# EAGLE design DAC STM32 Board v4 - AD5391 (EAGLE 9.6.1)
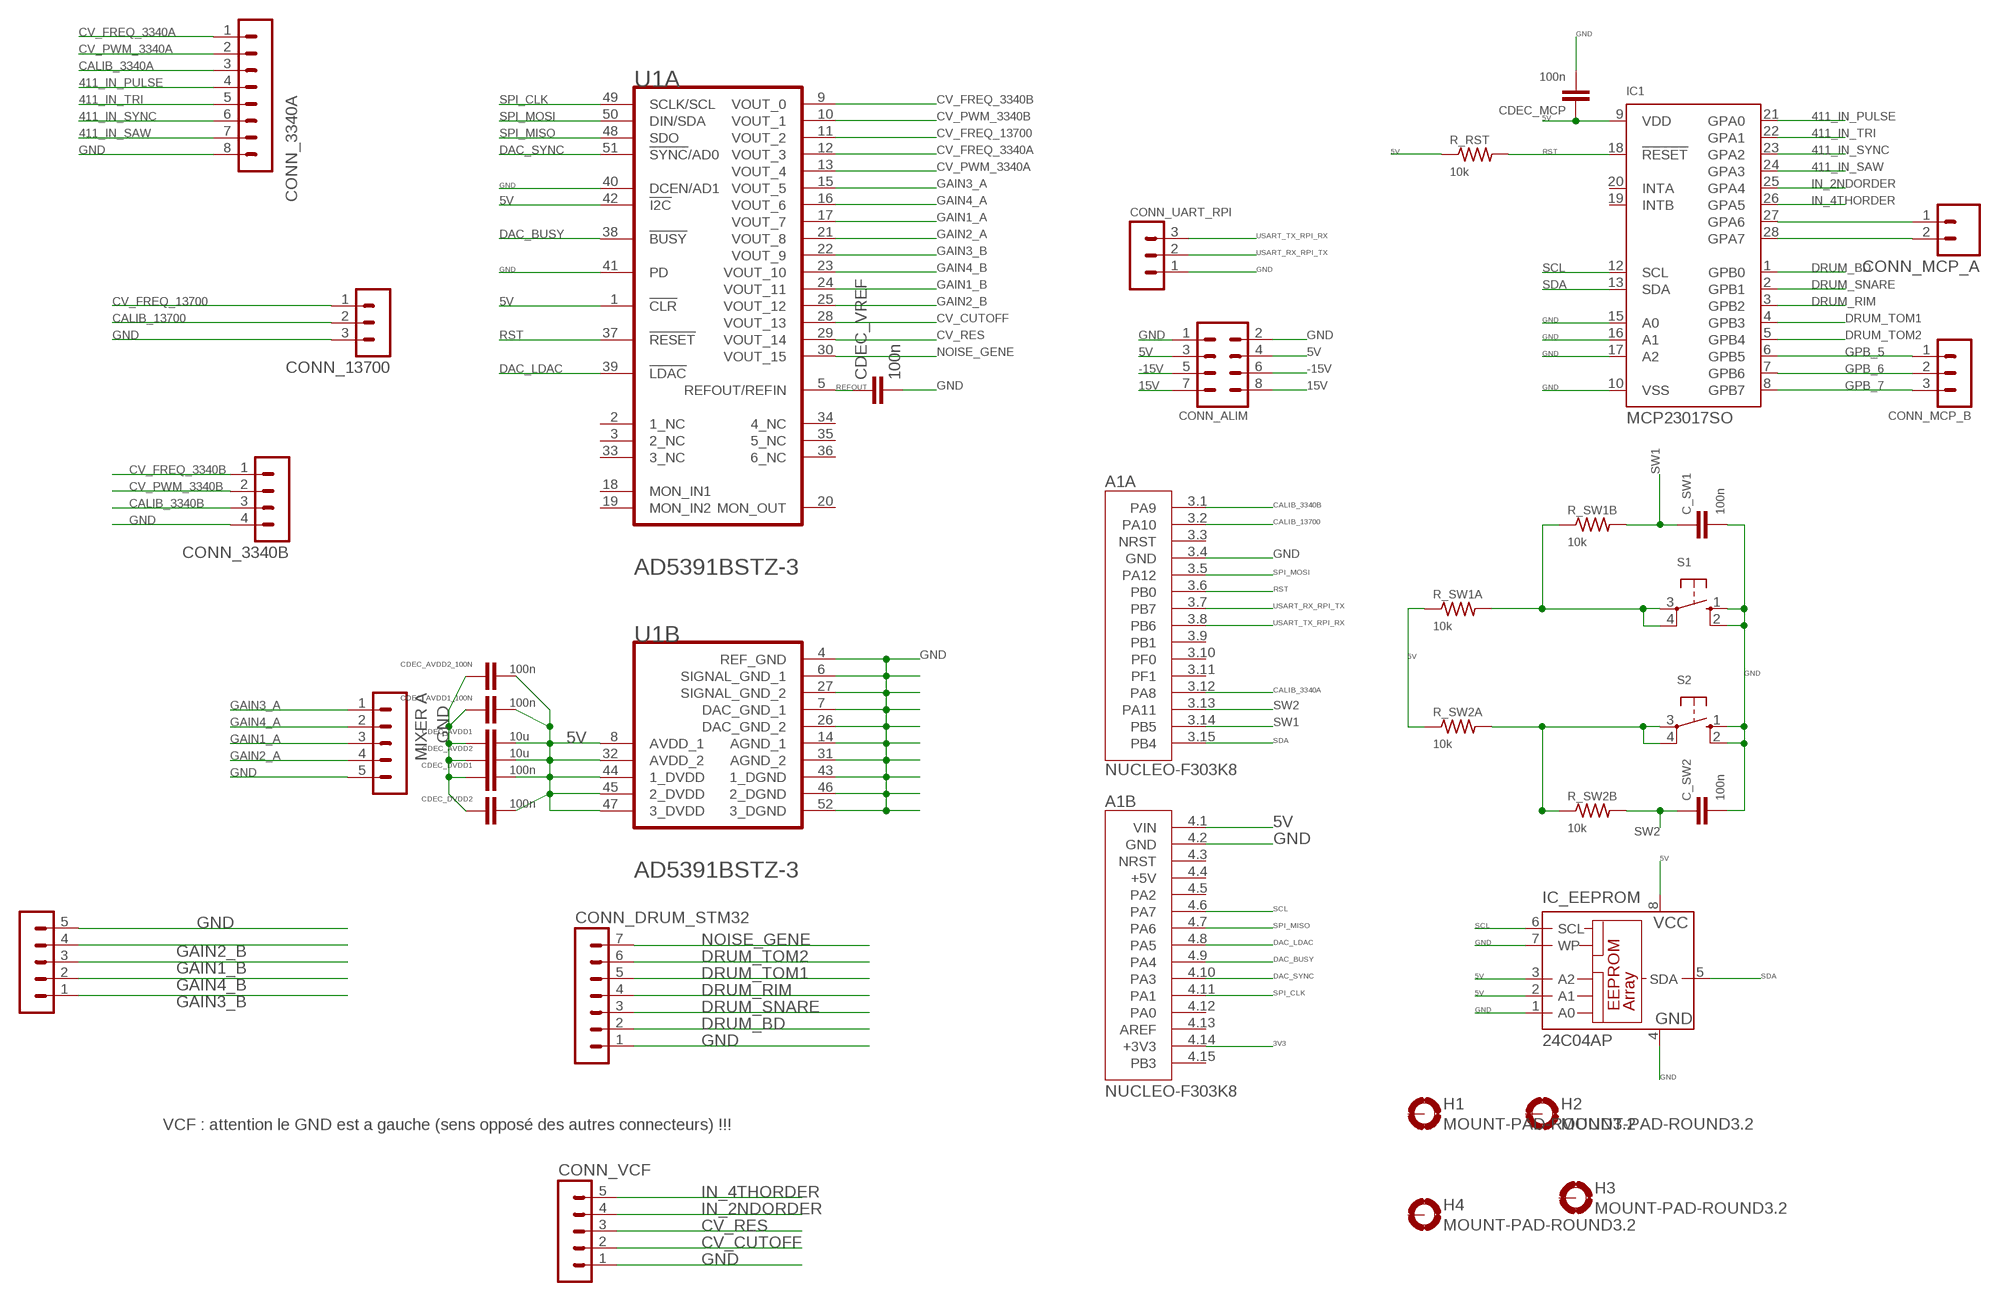
[diagram p0: schematic, sheet 1]

## Parts
A1  NUCLEO-F303K8  [MODULE_NUCLEO-F303K8]
C_SW1  100n  C-EU050-030X075  [C050-030X075]
C_SW2  100n  C-EU050-030X075  [C050-030X075]
CDEC_AVDD1  10u  C-EU050-030X075  [C050-030X075]
CDEC_AVDD1_100N  100n  C-EU050-030X075  [C050-030X075]
CDEC_AVDD2  10u  C-EU050-030X075  [C050-030X075]
CDEC_AVDD2_100N  100n  C-EU050-030X075  [C050-030X075]
CDEC_DVDD1  100n  C-EU075-032X103  [C075-032X103]
CDEC_DVDD2  100n  C-EU050-030X075  [C050-030X075]
CDEC_MCP  100n  C-EU075-032X103  [C075-032X103]
CDEC_VREF  100n  C-EU050-030X075  [C050-030X075]
CONN_3340A  MA08-1  [MA08-1]
CONN_3340B  MA04-1  [MA04-1]
CONN_13700  MA03-1  [MA03-1]
CONN_ALIM  MA04-2  [MA04-2]
CONN_DRUM_STM32  MA07-1  [MA07-1]
CONN_MCP_A  M02  [02P]
CONN_MCP_B  MA03-1  [MA03-1]
CONN_MIX_A  MA05-1  [MA05-1]
CONN_MIX_B  MA05-1  [MA05-1]
CONN_UART_RPI  MA03-1  [MA03-1]
CONN_VCF  MA05-1  [MA05-1]
H1  MOUNT-PAD-ROUND3.2  [3,2-PAD]
H2  MOUNT-PAD-ROUND3.2  [3,2-PAD]
H3  MOUNT-PAD-ROUND3.2  [3,2-PAD]
H4  MOUNT-PAD-ROUND3.2  [3,2-PAD]
IC1  MCP23017SO  [SO28W]
IC_EEPROM  24C04AP  [DIL8]
R_RST  10k  R-US_0207/10  [0207/10]
R_SW1A  10k  R-US_0207/10  [0207/10]
R_SW1B  10k  R-US_0207/10  [0207/10]
R_SW2A  10k  R-US_0207/10  [0207/10]
R_SW2B  10k  R-US_0207/10  [0207/10]
S1  10-XX  [B3F-10XX]
S2  10-XX  [B3F-10XX]
U1  ANALOG_DEVICES_AD5391BSTZ-3ANALOG_DEVICES_AD5391BSTZ-3_0_0  [ANALOG_DEVICES_AD5391BSTZ-3_0]

## Nets
3V3: A1.4.14(B:+3V3)
5V: A1.4.1(B:VIN) CDEC_AVDD1.2 CDEC_AVDD1_100N.2 CDEC_AVDD2.2 CDEC_AVDD2_100N.2 CDEC_DVDD1.2 CDEC_DVDD2.2 CDEC_MCP.1 CONN_ALIM.3 CONN_ALIM.4 IC1.9(VDD) IC_EEPROM.2(A1) IC_EEPROM.3(A2) IC_EEPROM.8(VCC) R_RST.1 R_SW1A.1 R_SW2A.1 U1.1(A:!CLR!) U1.8(B:AVDD_1) U1.32(B:AVDD_2) U1.42(A:!I2C!) U1.44(B:1_DVDD) U1.45(B:2_DVDD) U1.47(B:3_DVDD)
15V: CONN_ALIM.7 CONN_ALIM.8
411_IN_PULSE: CONN_3340A.4 IC1.21(GPA0)
411_IN_SAW: CONN_3340A.7 IC1.24(GPA3)
411_IN_SYNC: CONN_3340A.6 IC1.23(GPA2)
411_IN_TRI: CONN_3340A.5 IC1.22(GPA1)
-15V: CONN_ALIM.5 CONN_ALIM.6
CALIB_3340A: A1.3.12(A:PA8) CONN_3340A.3
CALIB_3340B: A1.3.1(A:PA9) CONN_3340B.3
CALIB_13700: A1.3.2(A:PA10) CONN_13700.2
CV_CUTOFF: CONN_VCF.2 U1.28(A:VOUT_13)
CV_FREQ_3340A: CONN_3340A.1 U1.12(A:VOUT_3)
CV_FREQ_3340B: CONN_3340B.1 U1.9(A:VOUT_0)
CV_FREQ_13700: CONN_13700.1 U1.11(A:VOUT_2)
CV_PWM_3340A: CONN_3340A.2 U1.13(A:VOUT_4)
CV_PWM_3340B: CONN_3340B.2 U1.10(A:VOUT_1)
CV_RES: CONN_VCF.3 U1.29(A:VOUT_14)
DAC_BUSY: A1.4.9(B:PA4) U1.38(A:!BUSY!)
DAC_LDAC: A1.4.8(B:PA5) U1.39(A:!LDAC!)
DAC_SYNC: A1.4.10(B:PA3) U1.51(A:!SYNC!/AD0)
DRUM_BD: CONN_DRUM_STM32.2 IC1.1(GPB0)
DRUM_RIM: CONN_DRUM_STM32.4 IC1.3(GPB2)
DRUM_SNARE: CONN_DRUM_STM32.3 IC1.2(GPB1)
DRUM_TOM1: CONN_DRUM_STM32.5 IC1.4(GPB3)
DRUM_TOM2: CONN_DRUM_STM32.6 IC1.5(GPB4)
GAIN1_A: CONN_MIX_A.3 U1.17(A:VOUT_7)
GAIN1_B: CONN_MIX_B.3 U1.24(A:VOUT_11)
GAIN2_A: CONN_MIX_A.4 U1.21(A:VOUT_8)
GAIN2_B: CONN_MIX_B.4 U1.25(A:VOUT_12)
GAIN3_A: CONN_MIX_A.1 U1.15(A:VOUT_5)
GAIN3_B: CONN_MIX_B.1 U1.22(A:VOUT_9)
GAIN4_A: CONN_MIX_A.2 U1.16(A:VOUT_6)
GAIN4_B: CONN_MIX_B.2 U1.23(A:VOUT_10)
GND: A1.3.4(A:GND) A1.4.2(B:GND) C_SW1.2 C_SW2.2 CDEC_AVDD1.1 CDEC_AVDD1_100N.1 CDEC_AVDD2.1 CDEC_AVDD2_100N.1 CDEC_DVDD1.1 CDEC_DVDD2.1 CDEC_MCP.2 CDEC_VREF.2 CONN_3340A.8 CONN_3340B.4 CONN_13700.3 CONN_ALIM.1 CONN_ALIM.2 CONN_DRUM_STM32.1 CONN_MIX_A.5 CONN_MIX_B.5 CONN_UART_RPI.1 CONN_VCF.1 IC1.10(VSS) IC1.15(A0) IC1.16(A1) IC1.17(A2) IC_EEPROM.1(A0) IC_EEPROM.4(GND) IC_EEPROM.7(WP) S1.1(S) S1.2(S1) S2.1(S) S2.2(S1) U1.4(B:REF_GND) U1.6(B:SIGNAL_GND_1) U1.7(B:DAC_GND_1) U1.14(B:AGND_1) U1.26(B:DAC_GND_2) U1.27(B:SIGNAL_GND_2) U1.31(B:AGND_2) U1.40(A:DCEN/AD1) U1.41(A:PD) U1.43(B:1_DGND) U1.46(B:2_DGND) U1.52(B:3_DGND)
GPB_5: CONN_MCP_B.1 IC1.6(GPB5)
GPB_6: CONN_MCP_B.2 IC1.7(GPB6)
GPB_7: CONN_MCP_B.3 IC1.8(GPB7)
IN_2NDORDER: CONN_VCF.4 IC1.25(GPA4)
IN_4THORDER: CONN_VCF.5 IC1.26(GPA5)
N$3: CONN_MCP_A.1 IC1.27(GPA6)
N$5: R_SW1A.2 R_SW1B.1 S1.3(P) S1.4(P1)
N$6: CONN_MCP_A.2 IC1.28(GPA7)
N$7: R_SW2A.2 R_SW2B.1 S2.3(P) S2.4(P1)
NOISE_GENE: CONN_DRUM_STM32.7 U1.30(A:VOUT_15)
REFOUT: CDEC_VREF.1 U1.5(A:REFOUT/REFIN)
RST: A1.3.6(A:PB0) IC1.18(!RESET) R_RST.2 U1.37(A:!RESET!)
SCL: A1.4.6(B:PA7) IC1.12(SCL) IC_EEPROM.6(SCL)
SDA: A1.3.15(A:PB4) IC1.13(SDA) IC_EEPROM.5(SDA)
SPI_CLK: A1.4.11(B:PA1) U1.49(A:SCLK/SCL)
SPI_MISO: A1.4.7(B:PA6) U1.48(A:SDO)
SPI_MOSI: A1.3.5(A:PA12) U1.50(A:DIN/SDA)
SW1: A1.3.14(A:PB5) C_SW1.1 R_SW1B.2
SW2: A1.3.13(A:PA11) C_SW2.1 R_SW2B.2
USART_RX_RPI_TX: A1.3.7(A:PB7) CONN_UART_RPI.2
USART_TX_RPI_RX: A1.3.8(A:PB6) CONN_UART_RPI.3
Unconnected: A1.3.3(A:NRST) A1.3.9(A:PB1) A1.3.10(A:PF0) A1.3.11(A:PF1) A1.4.3(B:NRST) A1.4.4(B:+5V) A1.4.5(B:PA2) A1.4.12(B:PA0) A1.4.13(B:AREF) A1.4.15(B:PB3) H1.B3,2(MOUNT) H2.B3,2(MOUNT) H3.B3,2(MOUNT) H4.B3,2(MOUNT) IC1.19(INTB) IC1.20(INTA) U1.2(A:1_NC) U1.3(A:2_NC) U1.18(A:MON_IN1) U1.19(A:MON_IN2) U1.20(A:MON_OUT) U1.33(A:3_NC) U1.34(A:4_NC) U1.35(A:5_NC) U1.36(A:6_NC)

## Notes on the sheet
- MIXER A
- VCF : attention le GND est a gauche (sens opposé des autres connecteurs) !!!

## Library data of the parts
A1 = NUCLEO-F303K8:NUCLEO-F303K8: STM32 Nucleo-32 development board with STM32F303K8T6 MCU, supports Arduino connectivity; DESCRIPTION: STM32 Nucleo-32 development board with STM32F303K8T6 MCU, supports Arduino connectivity; DIGI-KEY_PART_NUMBER: 497-15981-ND; DIGI-KEY_PURCHASE_URL: https://www.digikey.fr/product-detail/en/stmicroelectronics/NUCLEO-F303K8/497-15981-ND/5428805?utm_source=snapeda&utm_medium=aggregator&utm_campaign=symbol; MF: STMicroelectronics; MP: NUCLEO-F303K8; PACKAGE: None
C_SW1 C_SW2 CDEC_AVDD1 CDEC_AVDD1_100N CDEC_AVDD2 CDEC_AVDD2_100N CDEC_DVDD1 CDEC_DVDD2 CDEC_MCP CDEC_VREF = 6P1_EVB:C-EU: CAPACITOR, European symbol
CONN_3340A = con-lstb:MA08-1: PIN HEADER; OC_FARNELL: unknown; OC_NEWARK: unknown
CONN_3340B = con-lstb:MA04-1: PIN HEADER; OC_FARNELL: unknown; OC_NEWARK: unknown
CONN_13700 CONN_MCP_B CONN_UART_RPI = con-lstb:MA03-1: PIN HEADER; OC_FARNELL: unknown; OC_NEWARK: unknown
CONN_ALIM = con-lstb:MA04-2: PIN HEADER; OC_FARNELL: unknown; OC_NEWARK: unknown
CONN_DRUM_STM32 = con-lstb:MA07-1: PIN HEADER; OC_FARNELL: unknown; OC_NEWARK: unknown
CONN_MCP_A = con-amp-quick:M02: AMP QUICK CONNECTOR; OC_FARNELL: unknown; OC_NEWARK: unknown
CONN_MIX_A CONN_MIX_B CONN_VCF = con-lstb:MA05-1: PIN HEADER; OC_FARNELL: unknown; OC_NEWARK: unknown
H1-H4 = holes:MOUNT-PAD-ROUND: MOUNTING PAD, round
IC1 = microchip:MCP23017: http://ww1.microchip.com/downloads/en/DeviceDoc/21952a.pdf Source: http://ww1.microchip.com/downloads/en/DeviceDoc/21952a.pdf; MF: MICROCHIP; MPN: MCP23017-E/SO; OC_FARNELL: 1332087; OC_NEWARK: 31K2958
IC_EEPROM = microchip:24C*: Serial EEPROM 1 K/2 K/4 K; MPN: AT24C04B-PU; OC_FARNELL: 1362642; OC_NEWARK: 50M3315
R_RST R_SW1A R_SW1B R_SW2A R_SW2B = 6P1_EVB:R-US_: RESISTOR, American symbol
S1 S2 = switch-omron:10-XX: OMRON SWITCH; MPN: B3F-1000; OC_FARNELL: 176432; OC_NEWARK: 36M3542
U1 = Analog Devices - AD5391BSTZ-3:ANALOG_DEVICES_AD5391BSTZ-3: ADI-AD5391-ST-52; CIIVA_IDS: 963769; CODE__JEDEC: MS-026-BCC; COMPONENT_LINK_1_DESCRIPTION: Manufacturer URL; COMPONENT_LINK_1_URL: http://www.analog.com/en/index.html; COMPONENT_LINK_3_DESCRIPTION: Package Specification; COMPONENT_LINK_3_URL: http://www.analog.com/static/imported-files/packages/61012411624300842189414155189544791816408612ST_52_10x10.pdf; COMPONENT_LINK_4_DESCRIPTION: Product URL; COMPONENT_LINK_4_URL: http://www.analog.com/en/digital-to-analog-converters/da-converters/ad5391/products/product.html; COMPONENT_LINK_5_DESCRIPTION: Reference Design URL; COMPONENT_LINK_5_URL: http://www.analog.com/en/digital-to-analog-converters/da-converters/ad5391/products/product.html#prod_cross_sell; DAC_OUTPUTS: 16; DATASHEET: http://www.analog.com/static/imported-files/data_sheets/AD5390_5391_5392.pdf; DATASHEET_VERSION: Rev. D; FOOTPRINT_VARIANT_NAME_0: Level C; FOOTPRINT_VARIANT_NAME_1: Level B; FOOTPRINT_VARIANT_NAME_2: Level A; IMPORTED: yes; IMPORTED_FROM: vault; IMPORT_TS: 1521844584; MAX_V: 5.5V; MF: Analog Devices; MOUNTING_TECHNOLOGY: Surface Mount; MPN: AD5391BSTZ-3; PACKAGE: ST-52; PACKAGE_DESCRIPTION: 52-Lead Low Profile Quad Flat Package [LQFP]; PACKAGE_VERSION: 2003; PACKING: Tray; PIN_0_0_34_INSIDE_EDGE: clock; PREFIX: U; RELEASE_DATE: 1387056567; RESOLUTION_BITS: 12; ROHS: Yes; SETTLING_TIME: 6Âμs; SINGLE_SUPPLY: Yes; VAULT_GUID: 913198B3-F412-43EF-AC7C-B6DE02DEBA47; VAULT_REVISION: 29455BC3-2BA2-49F7-B0A5-12DEF9066172

## Board
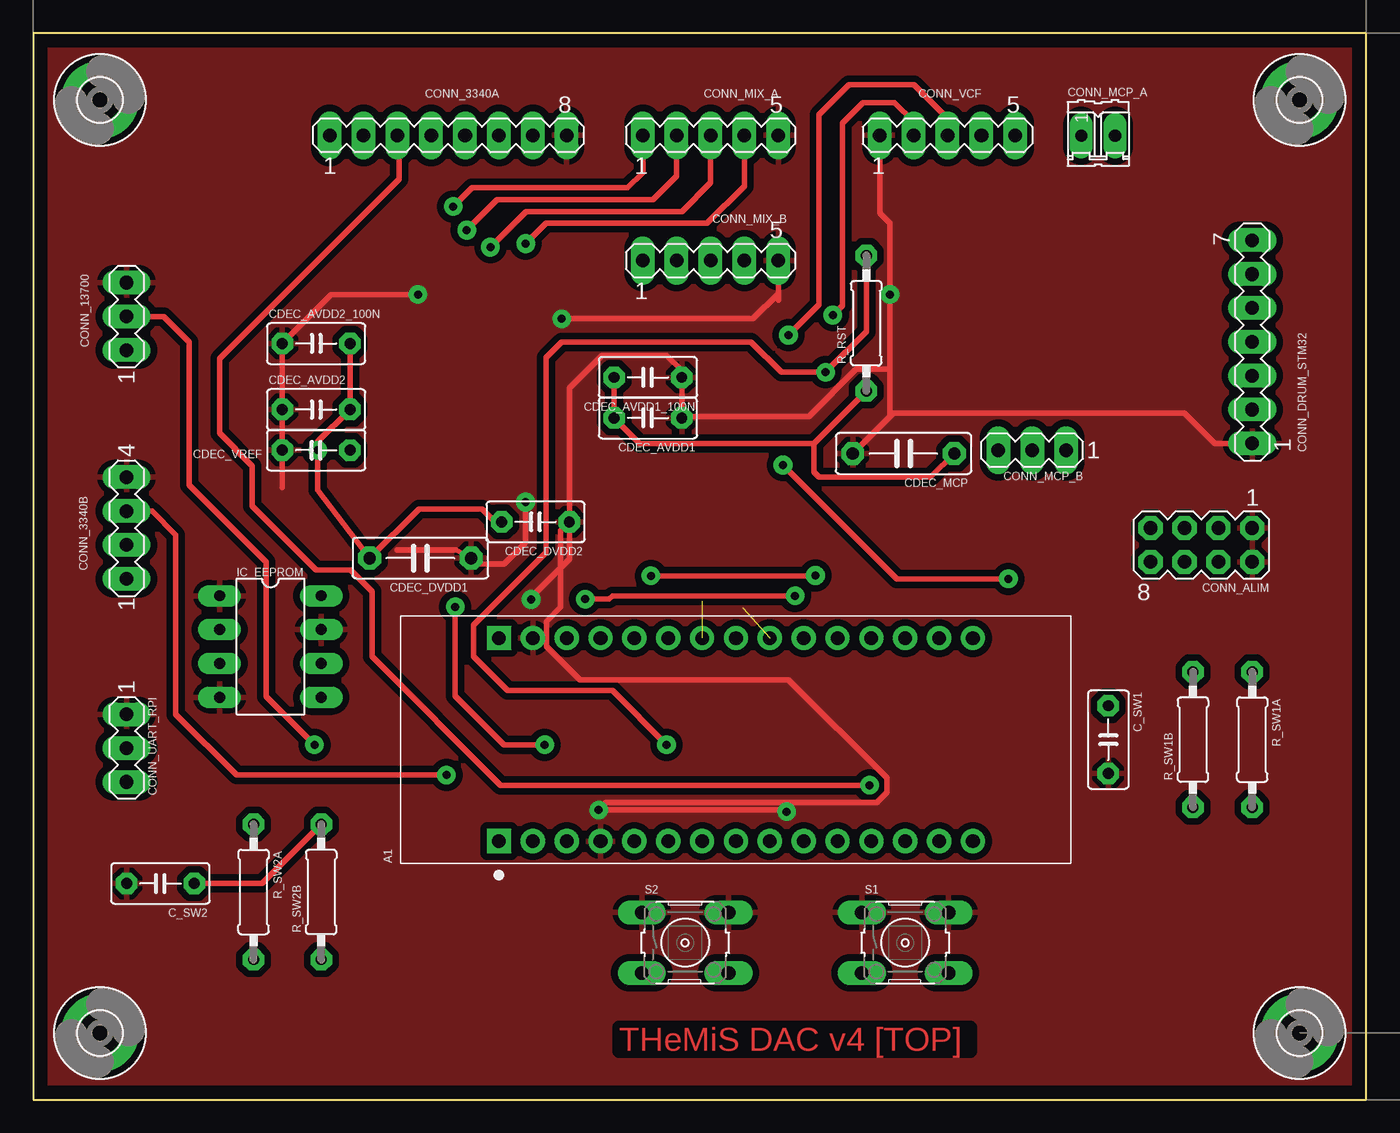
[diagram p1: board, top side]
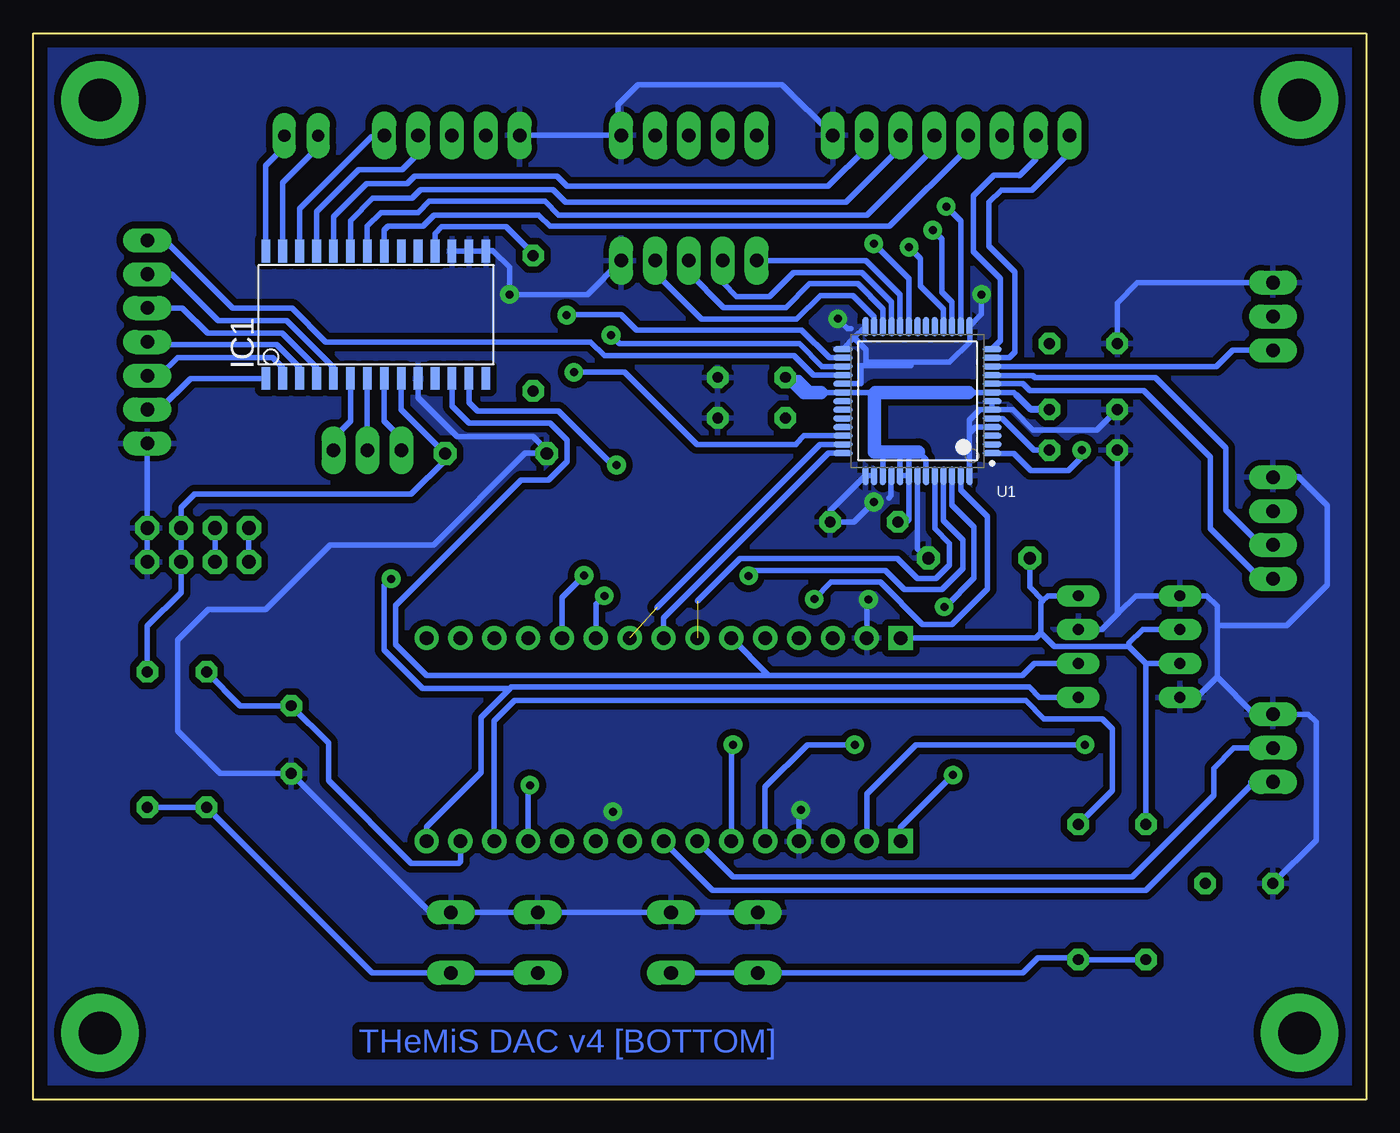
[diagram p2: board, bottom side, seen from below]

Size 100 x 80 mm. Coordinates in mm from the lower left corner, seen from the top.
Outline: 0,0 100,0 100,80 0,80 0,0
Copper layers (1*16): Top 0.035mm / dielectric 1.5mm / Bottom 0.035mm
Design rules "ENSEA_2019 *": minimum track width 0.4mm, minimum drill 0.6mm, track to track 0.4mm, track to pad 0.4mm, pad to pad 0.4mm, via to via 0.4mm, smd to smd 0.4mm, copper to edge 1mm, drill to drill 0.4mm, minimum pad ring 0.4mm, minimum via ring 0.4mm, stop-mask expansion 4mil, vias tented up to drill 0mil, thermal gap 0.4mm

### Footprints (pad centres in the part's own frame; a part is rotated, then mirrored left to right if it is on the bottom)
MODULE_NUCLEO-F303K8 = drill 1.02 square: 3.1 -7.62,17.78; 4.1 7.62,17.78 | drill 1.02: 3.2 -7.62,15.24; 3.3 -7.62,12.7; 3.4 -7.62,10.16; 3.5 -7.62,7.62; 3.6 -7.62,5.08; 3.7 -7.62,2.54; 3.8 -7.62,0; 3.9 -7.62,-2.54; 3.10 -7.62,-5.08; 3.11 -7.62,-7.62; 3.12 -7.62,-10.16; 3.13 -7.62,-12.7; 3.14 -7.62,-15.24; 3.15 -7.62,-17.78; 4.2 7.62,15.24; 4.3 7.62,12.7; 4.4 7.62,10.16; 4.5 7.62,7.62; 4.6 7.62,5.08; 4.7 7.62,2.54; 4.8 7.62,0; 4.9 7.62,-2.54; 4.10 7.62,-5.08; 4.11 7.62,-7.62; 4.12 7.62,-10.16; 4.13 7.62,-12.7; 4.14 7.62,-15.24; 4.15 7.62,-17.78
C050-030X075 = drill 0.813 octagon: 1 -2.54,0; 2 2.54,0
C075-032X103 = drill 0.914 octagon: 1 -3.81,0; 2 3.81,0
MA08-1 = drill 1.016 long: 1 -8.89,0; 2 -6.35,0; 3 -3.81,0; 4 -1.27,0; 5 1.27,0; 6 3.81,0; 7 6.35,0; 8 8.89,0
MA04-1 = drill 1.016 long: 1 -3.81,0; 2 -1.27,0; 3 1.27,0; 4 3.81,0
MA03-1 = drill 1.016 long: 1 -2.54,0; 2 0,0; 3 2.54,0
MA04-2 = drill 1.016 octagon: 1 -3.81,-1.27; 2 -3.81,1.27; 3 -1.27,-1.27; 4 -1.27,1.27; 5 1.27,-1.27; 6 1.27,1.27; 7 3.81,-1.27; 8 3.81,1.27
MA07-1 = drill 1.016 long: 1 -7.62,0; 2 -5.08,0; 3 -2.54,0; 4 0,0; 5 2.54,0; 6 5.08,0; 7 7.62,0
02P = drill 0.914 long: 1 -1.27,0; 2 1.27,0
MA05-1 = drill 1.016 long: 1 -5.08,0; 2 -2.54,0; 3 0,0; 4 2.54,0; 5 5.08,0
3,2-PAD = drill 3.2 pad 5.842: B3,2 0,0
SO28W = smd 0.65 x 1.7: 1 -7.62,-4.78; 2 -6.35,-4.78; 3 -5.08,-4.78; 4 -3.81,-4.78; 5 -2.54,-4.78; 6 -1.27,-4.78; 7 0,-4.78; 8 1.27,-4.78; 9 2.54,-4.78; 10 3.81,-4.78; 11 5.08,-4.78; 12 6.35,-4.78; 13 7.62,-4.78; 14 8.89,-4.78; 15 8.89,4.78; 16 7.62,4.78; 17 6.35,4.78; 18 5.08,4.78; 19 3.81,4.78; 20 2.54,4.78; 21 1.27,4.78; 22 0,4.78; 23 -1.27,4.78; 24 -2.54,4.78; 25 -3.81,4.78; 26 -5.08,4.78; 27 -6.35,4.78; 28 -7.62,4.78
DIL8 = drill 0.813 long: 1 -3.81,-3.81; 2 -1.27,-3.81; 3 1.27,-3.81; 4 3.81,-3.81; 5 3.81,3.81; 6 1.27,3.81; 7 -1.27,3.81; 8 -3.81,3.81
0207/10 = drill 0.813 octagon: 1 -5.08,0; 2 5.08,0
B3F-10XX = drill 1.016 long: 1 -3.251,2.261; 2 3.251,2.261; 3 -3.251,-2.261; 4 3.251,-2.261
ANALOG_DEVICES_AD5391BSTZ-3_0 = smd 1.45 x 0.45: 1 -5.6,3.9; 2 -5.6,3.25; 3 -5.6,2.6; 4 -5.6,1.95; 5 -5.6,1.3; 6 -5.6,0.65; 7 -5.6,0; 8 -5.6,-0.65; 9 -5.6,-1.3; 10 -5.6,-1.95; 11 -5.6,-2.6; 12 -5.6,-3.25; 13 -5.6,-3.9; 27 5.6,-3.9; 28 5.6,-3.25; 29 5.6,-2.6; 30 5.6,-1.95; 31 5.6,-1.3; 32 5.6,-0.65; 33 5.6,0; 34 5.6,0.65; 35 5.6,1.3; 36 5.6,1.95; 37 5.6,2.6; 38 5.6,3.25; 39 5.6,3.9 | smd 0.45 x 1.45: 14 -3.9,-5.6; 15 -3.25,-5.6; 16 -2.6,-5.6; 17 -1.95,-5.6; 18 -1.3,-5.6; 19 -0.65,-5.6; 20 0,-5.6; 21 0.65,-5.6; 22 1.3,-5.6; 23 1.95,-5.6; 24 2.6,-5.6; 25 3.25,-5.6; 26 3.9,-5.6; 40 3.9,5.6; 41 3.25,5.6; 42 2.6,5.6; 43 1.95,5.6; 44 1.3,5.6; 45 0.65,5.6; 46 0,5.6; 47 -0.65,5.6; 48 -1.3,5.6; 49 -1.95,5.6; 50 -2.6,5.6; 51 -3.25,5.6; 52 -3.9,5.6

### Placement (x,y rotation side)
A1  52.72,27 90 top
C_SW1  80.66,27 270 top
C_SW2  9.54,16.21 180 top
CDEC_AVDD1  46.11,51.13 180 top
CDEC_AVDD1_100N  46.11,54.18 180 top
CDEC_AVDD2  21.22,51.77 0 top
CDEC_AVDD2_100N  21.22,56.72 0 top
CDEC_DVDD1  29.04,40.62 180 top
CDEC_DVDD2  37.68,43.34 180 top
CDEC_MCP  65.29,48.47 180 top
CDEC_VREF  21.22,48.72 180 top
CONN_3340A  31.12,72.34 0 top
CONN_3340B  7,42.88 90 top
CONN_13700  7,58.76 90 top
CONN_ALIM  87.64,41.61 180 top
CONN_DRUM_STM32  91.45,56.85 90 top
CONN_MCP_A  79.89,72.32 0 top
CONN_MCP_B  74.94,48.72 180 top
CONN_MIX_A  50.81,72.34 0 top
CONN_MIX_B  50.81,62.95 0 top
CONN_UART_RPI  7,26.37 270 top
CONN_VCF  68.59,72.34 0 top
H1  5,5 0 top
H2  95,5 0 top
H3  95,75 0 top
H4  5,75 0 top
IC1  74.94,58.88 0 bottom
IC_EEPROM  17.79,33.99 270 top
R_RST  62.49,58.25 90 top
R_SW1A  91.45,27 270 top
R_SW1B  87,27 90 top
R_SW2A  16.52,15.57 270 top
R_SW2B  21.6,15.57 90 top
S1  65.42,11.77 0 top
S2  48.91,11.77 0 top
U1  33.66,52.41 180 bottom

### Tracks (layer width: path | path; a pad name or v marks a point on that pad's centre or on a via)
5V  (via drill 0.6)
  Top 0.4: CDEC_AVDD1_100N.2 CDEC_AVDD1.2 45.48,49.23 58.56,49.23 | CDEC_AVDD2_100N.2 CDEC_AVDD2.2 21.35,49.36 v21.35,48.72 21.35,45.72 CDEC_DVDD1.2 28.94,44.32 33.67,44.32 34.66,43.34 CDEC_DVDD2.2 | R_RST.1 58.56,49.23 | CDEC_MCP.1 67.32,46.69 58.94,46.69 58.56,47.07 58.56,49.23
  Bottom 0.4: IC1.9 72.4,51.77 CDEC_MCP.1 69.1,47.96 71.64,45.42 87.89,45.42 88.91,44.4 CONN_ALIM.3 CONN_ALIM.4 88.91,38.05 91.45,35.51 R_SW1A.1 | CDEC_AVDD1_100N.2 43.31,54.18 42.55,54.18 41.43,53.05 | 40.89,53.05 U1.32 36.83,53.05 | 26.43,53.04 U1.8 29.84,53.05 | U1.1 28.03,48.47 26.43,48.47 25.16,47.2 22.36,47.2 21.35,48.21 v21.35,48.72 | U1.45 U1.44 34.97,48.58 34.95,48.59 | U1.45 34.31,43.53 34.51,43.34 CDEC_DVDD2.2 | IC_EEPROM.8 23.89,37.8 24.24,37.45 | 24.24,37.45 24.39,37.29 24.39,35.01 | 24.39,35.01 23.38,33.99 17.79,33.99 | 16.52,32.72 17.79,33.99 | 16.52,32.72 IC_EEPROM.3 | 17.79,33.99 17.79,34.24 16.77,35.26 IC_EEPROM.2 | A1.4.1 24.77,34.62 24.39,35.01 | R_SW2A.1 16.52,32.72 | CDEC_DVDD1.2 25.23,38.44 24.24,37.45 | U1.47 33.02,48 33.6,48.59 34.37,48.59 | 34.37,48.59 34.95,48.59 | 34.95,48.59 36.27,48.59 U1.42 | U1.45 34.31,48.54 34.37,48.59
  Bottom 0.508: CDEC_AVDD2.2 25.16,51.77 26.24,52.85
  Bottom 1.016: 29.84,53.05 36.83,53.05 36.9,52.98 36.9,48.59 36.27,48.59 33.6,48.59 | 43.31,54.18 42.18,53.05 41.43,53.05 40.89,53.05
15V
  Bottom 0.4: CONN_ALIM.7 CONN_ALIM.8
411_IN_PULSE
  Bottom 0.4: IC1.21 73.67,65.23 73.39,65.52 70.77,65.52 69.92,66.38 62.08,66.38 61.22,65.52 35.77,65.52 29.86,71.44 CONN_3340A.4
411_IN_SAW
  Bottom 0.4: IC1.24 77.48,66.25 74.99,68.74 71.94,68.74 71.38,69.3 60.72,69.3 59.95,68.53 40.38,68.53 37.48,71.44 CONN_3340A.7
411_IN_SYNC
  Bottom 0.4: IC1.23 76.21,65.94 74.54,67.62 71.59,67.62 70.93,68.28 61.02,68.28 60.08,67.34 39.03,67.34 34.94,71.44 CONN_3340A.6
411_IN_TRI
  Bottom 0.4: IC1.22 74.94,65.54 73.92,66.56 71.13,66.56 70.3,67.39 61.62,67.39 60.59,66.36 37.47,66.36 32.4,71.44 CONN_3340A.5
-15V
  Bottom 0.4: CONN_ALIM.5 CONN_ALIM.6
CALIB_3340A  (via drill 0.6)
  Top 0.4: v62.75,23.58 35.06,23.58 25.41,33.23 25.41,38.13 23.81,39.73 21.23,39.73 16.43,44.53 16.43,47.54 13.98,49.99 13.98,55.58 27.44,69.04 27.44,72.22 CONN_3340A.3
  Bottom 0.4: A1.3.12 62.88,23.45 v62.75,23.58
CALIB_3340B  (via drill 0.6)
  Top 0.4: v31,24.34 15.25,24.34 10.68,28.91 10.68,42.37 8.9,44.15 CONN_3340B.3
  Bottom 0.4: v31,24.34 34.94,20.4 A1.3.1
CALIB_13700  (via drill 0.6)
  Top 0.4: v21.09,26.62 17.47,30.24 17.47,40.34 11.69,46.12 11.69,56.85 9.79,58.76 CONN_13700.2
  Bottom 0.4: A1.3.2 37.48,22.94 33.79,26.62 v21.09,26.62
CV_CUTOFF  (via drill 0.6)
  Top 0.4: v59.98,58.85 60.72,59.58 60.72,73.27 62.24,74.79 64.62,74.79 66.05,73.36 CONN_VCF.2
  Bottom 0.4: U1.28 40.28,55.66 42.36,57.74 54.75,57.74 55.89,58.88 59.95,58.88 v59.98,58.85
CV_FREQ_3340A
  Bottom 0.4: U1.12 26.77,55.66 26.36,56.07 26.36,62.08 28.32,64.04 28.32,65.76 28.31,65.77 28.31,67.32 27.38,68.25 25.07,68.25 22.38,70.94 22.38,72.2 CONN_3340A.1
CV_FREQ_3340B
  Bottom 0.4: U1.9 25.75,53.7 25.25,53.2 16.68,53.2 11.69,48.21 11.69,42.86 7.9,39.07 CONN_3340B.1
CV_FREQ_13700
  Bottom 0.4: CONN_13700.1 10.02,56.22 11.23,55.01 U1.11
CV_PWM_3340A
  Bottom 0.4: CONN_3340A.2 24.77,70.57 26.02,69.32 26.04,69.34 27.94,69.34 29.46,67.82 29.46,63.63 27.43,61.59 27.43,56.94 U1.13
CV_PWM_3340B
  Bottom 0.4: U1.10 28.04,54.33 25.02,54.33 24.87,54.18 15.81,54.18 10.53,48.9 10.53,44.23 7.9,41.61 CONN_3340B.2
CV_RES  (via drill 0.6)
  Top 0.4: v56.65,57.36 58.94,59.64 58.94,73.9 61.19,76.15 66.05,76.15 68.59,73.61 CONN_VCF.3
  Bottom 0.4: v56.65,57.36 56.02,56.72 42.53,56.72 40.81,55.01 U1.29
DAC_BUSY  (1 unrouted)
  Bottom 0.4: U1.38 40.98,49.16
  Bottom 0.406: 40.98,49.16 40.99,49.16 53.21,36.93
DAC_LDAC
  Bottom 0.4: A1.4.8 52.72,36.15 40.36,48.51 U1.39
DAC_SYNC  (via drill 0.6)
  Top 0.4: v57.16,37.8 43.44,37.8 43.19,37.55 v41.41,37.55
  Bottom 0.4: U1.51 30.41,45.74 28.44,43.76 28.44,38.32 31.1,35.66 33.3,35.66 36.46,38.82 40.14,38.82 v41.41,37.55 | A1.4.10 57.8,37.16 v57.16,37.8
DRUM_BD
  Bottom 0.4: CONN_DRUM_STM32.2 90.54,51.77 88.21,54.1 IC1.1
DRUM_RIM
  Bottom 0.4: CONN_DRUM_STM32.4 91.25,56.65 81.76,56.65 80.02,54.91 IC1.3
DRUM_SNARE
  Bottom 0.4: CONN_DRUM_STM32.3 90.54,54.31 89.17,55.68 82.06,55.68 81.29,54.91 IC1.2
DRUM_TOM1
  Bottom 0.4: CONN_DRUM_STM32.5 88.82,59.39 86.93,57.5 81.34,57.5 78.75,54.91 IC1.4
DRUM_TOM2
  Bottom 0.4: CONN_DRUM_STM32.6 89.61,61.93 86.12,58.44 81.01,58.44 77.48,54.91 IC1.5
GAIN1_A  (via drill 0.6)
  Top 0.4: v34.3,63.96 36.97,66.63 48.65,66.63 50.81,68.79 CONN_MIX_A.3
  Bottom 0.4: U1.17 31.71,59.31 33.43,61.02 33.43,63.09 v34.3,63.96
GAIN1_B
  Bottom 0.4: CONN_MIX_B.3 50.81,62.04 48.21,59.44 43.54,59.44 41.77,61.2 38.14,61.2 36.27,59.32 U1.24
GAIN2_A  (via drill 0.6)
  Top 0.4: v36.95,64.22 38.47,65.74 50.56,65.74 53.35,68.53 CONN_MIX_A.4
  Bottom 0.4: U1.21 34.31,61.58 v36.95,64.22
GAIN2_B
  Bottom 0.4: CONN_MIX_B.4 53.35,62.04 49.86,58.55 42.73,58.55 40.95,60.34 38.51,60.34 36.91,58.74 U1.25
GAIN3_A  (via drill 0.6)
  Top 0.4: v31.51,67.01 32.9,68.41 44.59,68.41 45.73,69.55 CONN_MIX_A.1
  Bottom 0.4: U1.15 30.41,65.92 v31.51,67.01
GAIN3_B
  Bottom 0.4: CONN_MIX_B.1 37.52,62.95 34.97,60.4 U1.22
GAIN4_A  (via drill 0.6)
  Top 0.4: v32.52,65.23 34.81,67.52 46.49,67.52 48.27,69.3 CONN_MIX_A.2
  Bottom 0.4: U1.16 31.07,59.82 31.84,60.59 31.84,64.55 v32.52,65.23
GAIN4_B
  Bottom 0.4: U1.23 35.62,59.82 37.82,62.02 42.98,62.02 44.77,60.24 47.23,60.24 48.27,61.28 CONN_MIX_B.2
GND  (via drill 0.6)
  Top 0.4: 48.65,51.26 CDEC_AVDD1_100N.1 48.65,54.69 47.51,55.83 42.68,55.83 40.22,53.37 CDEC_DVDD2.1 | 48.65,51.26 CDEC_AVDD1.1 | 64.27,54.82 64.27,51.26 CDEC_MCP.2 64.53,51.52 86.37,51.52 88.66,49.23 CONN_DRUM_STM32.1 | 64.27,54.82 v64.27,60.41 64.27,65.74 63.51,66.5 CONN_VCF.1 | 64.27,54.82 61.73,54.82 58.18,51.26 48.65,51.26 | 27.3,41.23 31.73,41.23 CDEC_DVDD1.1 33.29,40.18 35.31,40.18 36.93,41.81 v36.93,44.83 36.88,44.83 | 18.68,45.93 CDEC_VREF.2 CDEC_AVDD2.1 CDEC_AVDD2_100N.1 22.36,60.4 v28.85,60.4 | CDEC_DVDD2.1 40.22,40.54 37.35,37.67 v37.35,37.52 | CDEC_DVDD2.1 39.56,42.68 39.56,36.94 38.51,35.88 38.51,34 41.02,31.49 56.67,31.49 64.05,24.11 64.05,23.04 63.29,22.28 42.98,22.28 v42.42,21.72 56.39,21.72 v56.52,21.59 | 55.91,59.99 55.89,60.01 CONN_MIX_B.5 55.89,60.49 53.98,58.58 v39.65,58.58
  Bottom 0.4: U1.6 U1.7 | U1.6 26.5,51.76 24.99,50.25 20.2,50.25 CDEC_AVDD2.1 | U1.52 29.77,50 | 29.77,50 29.31,50.45 U1.4 | U1.6 28.98,51.76 29.77,50.97 29.77,50 | U1.41 U1.40 40.22,44.15 CDEC_DVDD2.1 38.42,43.34 v36.93,44.83 | U1.31 37.92,53.7 37.92,55.06 37.52,55.06 | 37.52,55.06 34.15,55.06 | IC1.17 IC1.16 IC1.15 66,63.71 65.54,63.71 64.27,62.44 v64.27,60.41 58.43,60.41 CONN_MIX_B.5 | IC1.10 71.13,52.66 68.21,49.74 62.49,49.74 61.48,48.72 CDEC_MCP.2 61.51,48.5 63.1,48.5 69.99,41.61 77.73,41.61 82.56,36.78 86.88,36.78 89.16,34.5 89.16,27.64 85.99,24.46 C_SW1.2 70.22,14.03 S1.2 S1.1 S2.2 S2.1 | 56.14,72.34 CONN_MIX_A.5 | IC_EEPROM.7 19.82,35.26 18.55,36.53 | 18.55,36.53 17.28,37.8 IC_EEPROM.1 11.95,37.8 11.19,37.04 11.19,35.56 | CDEC_VREF.2 18.68,36.66 18.55,36.53 | 11.19,35.56 11.19,31.7 | IC_EEPROM.4 12.71,30.18 11.19,31.7 | CONN_3340A.8 43.83,76.15 54.62,76.15 56.14,74.63 56.14,72.34 | CONN_VCF.1 56.14,72.34 | v37.35,37.52 37.48,37.39 A1.4.2 | U1.27 38.41,57.16 | 38.41,57.16 U1.26 | 37.52,55.06 37.52,55.33 | 37.52,55.33 37.52,56.26 38.41,57.16 | 37.52,55.33 31.25,55.33 29.73,56.85 29.73,57.97 U1.14 28.85,58.92 v28.85,60.4 | CDEC_AVDD2_100N.1 18.68,59.77 17.16,61.3 CONN_13700.3 | 11.19,31.7 8.39,28.91 CONN_UART_RPI.1 4.33,28.91 3.75,28.33 3.75,19.45 C_SW2.2 | CONN_DRUM_STM32.1 CONN_ALIM.1 CONN_ALIM.2 | 11.19,35.56 5.97,35.56 2.92,38.61 2.92,44.58 5.08,46.74 6.95,46.74 CONN_3340B.4 | U1.46 33.66,41.31 32.97,40.62 CDEC_DVDD1.1 | v42.42,21.72 42.55,21.58 A1.3.4 | v39.65,58.58 38.91,57.84 38.66,57.84 | 35.81,45.14 35.64,45.31 35.64,46.78 U1.43
  pour Top (isolate 0.5): 0,80 100,80 100,0 0,0
  pour Bottom (isolate 0.5): 0,80 100,80 100,0 0,0
GPB_5
  Bottom 0.4: IC1.6 76.21,50.9 77.48,49.63 CONN_MCP_B.1
GPB_6
  Bottom 0.4: IC1.7 CONN_MCP_B.2
GPB_7
  Bottom 0.4: IC1.8 73.67,50.9 72.4,49.63 CONN_MCP_B.3
IN_2NDORDER
  Bottom 0.4: CONN_VCF.4 71.13,70.95 72.33,69.75 75.6,69.75 78.75,66.6 IC1.25
IN_4THORDER
  Bottom 0.4: CONN_VCF.5 74,72.34 74.09,72.25 74.62,72.25 80.02,66.86 IC1.26
N$3
  Bottom 0.4: IC1.27 81.29,68.79 78.62,71.46 CONN_MCP_A.1
N$5
  Bottom 0.4: R_SW1A.2 R_SW1B.1 74.58,9.5 S1.4 S1.3
N$6
  Bottom 0.4: IC1.28 82.56,70.06 81.16,71.46 CONN_MCP_A.2
N$7
  Bottom 0.4: S2.4 S2.3 25.77,9.5 24.65,10.62 21.73,10.62 R_SW2B.1 R_SW2A.2
NOISE_GENE
  Bottom 0.4: CONN_DRUM_STM32.7 90.13,64.47 85.03,59.37 80.58,59.37 78.06,56.85 58.18,56.85 57.16,55.83 42.94,55.83 41.46,54.35 U1.30
REFOUT
  Bottom 0.4: U1.5 28.04,51.08 27.31,51.08 24.95,48.72 CDEC_VREF.1
RST  (via drill 0.6)
  Top 0.4: R_RST.2 62.49,57.61 v59.45,54.56 56.14,54.56 53.86,56.85 39.63,56.85 38.47,55.68 38.47,41.03 33.03,35.59 33.03,33.23 35.57,30.69 43.44,30.69 v47.51,26.62
  Bottom 0.4: U1.37 42.16,49.8 42.8,49.17 42.8,49.15 50.21,49.15 55.63,54.56 v59.45,54.56 | IC1.18 69.86,64.98 69.35,65.49 64.53,65.49 62.49,63.45 R_RST.2 | A1.3.6 47.63,26.5 v47.51,26.62
SCL
  Bottom 0.4: IC1.12 68.59,52.02 67.32,50.75 61.22,50.75 59.97,49.5 59.97,47.89 61.36,46.5 63.39,46.5 72.82,37.07 72.82,34.15 70.5,31.83 44.84,31.83 | A1.4.6 44.84,31.83 | 44.84,31.83 25.79,31.83 24.9,32.72 IC_EEPROM.6
SDA  (via drill 0.6)
  Top 0.4: v56.24,47.61 64.78,39.07 v73.16,39.07
  Bottom 0.4: IC1.13 67.32,52.28 66.69,51.64 60.59,51.64 56.4,47.45 v56.24,47.61 | 64.24,30.84 66.4,28.68 66.4,24.54 70.5,20.45 A1.3.15 | 64.24,30.84 64.14,30.94 25.28,30.94 24.52,30.18 IC_EEPROM.5 | v73.16,39.07 73.67,38.56 73.67,33.74 70.78,30.84 64.24,30.84
SPI_CLK  (via drill 0.6)
  Top 0.4: v46.33,39.29 58.65,39.29 v58.68,39.32
  Bottom 0.4: U1.49 31.71,43.43 30.27,41.99 30.27,39.84 31.84,38.27 34.63,38.27 36.07,39.7 46.11,39.7 46.33,39.49 v46.33,39.29 | v58.68,39.32 60.34,37.67 A1.4.11
SPI_MISO  (1 unrouted)
  Bottom 0.4: U1.48 32.37,42.85 31.25,41.74 31.25,40.12 32.28,39.09 33.68,39.09 35.18,40.59 47,40.59 50.17,37.42
SPI_MOSI  (via drill 0.6)
  Top 0.4: v31.66,36.97 31.66,30.28 35.32,26.62 v38.36,26.62
  Bottom 0.4: U1.50 31.07,44.6 29.42,42.95 29.42,39.13 31.58,36.97 v31.66,36.97 | v38.36,26.62 41.92,26.62 45.09,23.45 A1.3.5
SW1
  Bottom 0.4: R_SW1B.2 84.47,29.55 C_SW1.1 77.86,26.75 77.86,23.96 71.64,17.73 68.08,17.73 67.95,17.86 A1.3.14
SW2
  Top 0.4: R_SW2B.2 17.16,16.21 C_SW2.1
  Bottom 0.4: A1.3.13 65.42,28.4 63.89,29.93 25.54,29.93 24.19,28.57 19.81,28.57 19.06,27.82 19.06,23.2 R_SW2B.2
USART_RX_RPI_TX
  Bottom 0.4: A1.3.7 47.51,16.72 17.54,16.72 11.44,22.81 11.44,24.85 9.92,26.37 CONN_UART_RPI.2
USART_TX_RPI_RX
  Bottom 0.4: A1.3.8 49.03,15.7 16.52,15.7 8.65,23.58 8.65,23.83 CONN_UART_RPI.3

### Text on the board
Top: THeMiS DAC v4 [TOP]
Bottom: THeMiS DAC v4 [BOTTOM]